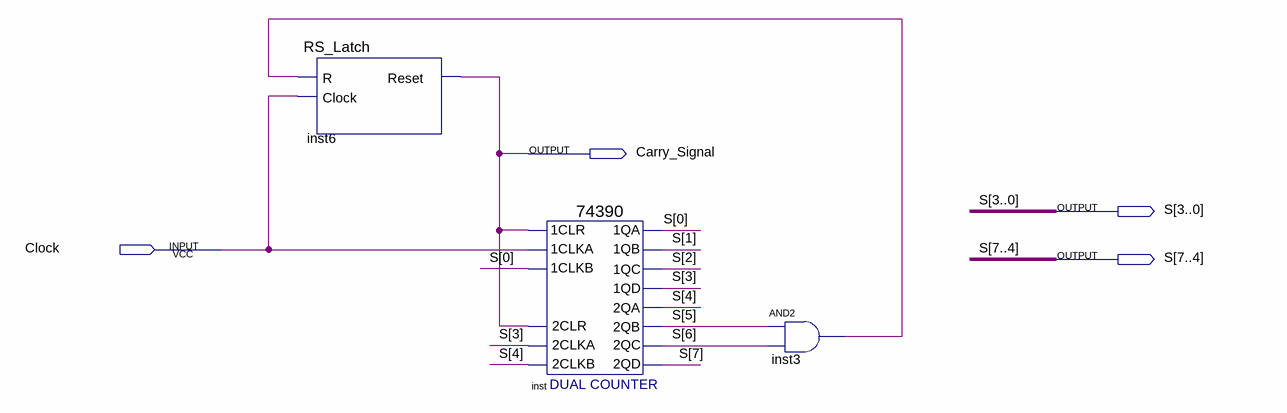
[diagram p0: schematic sheet]
// Quartus schematic Count_Second.bdf as structural Verilog: 3 symbols, 4 pins
module Count_Second (
  input  Clock,
  output Carry_Signal,
  output [7:0] S
);

  wire inst3_out;

  RS_Latch inst6 (.R(inst3_out), .Clock(Clock), .Reset(Carry_Signal));
  \74390  inst (
    .\2CLKA (S[3]), .\2CLR (Carry_Signal), .\2CLKB (S[4]), .\1CLR (Carry_Signal), .\1CLKA (Clock),
    .\1CLKB (S[0]), .\1QA (S[0]), .\1QB (S[1]), .\1QC (S[2]), .\1QD (S[3]), .\2QA (S[4]), .\2QB (S[5]),
    .\2QC (S[6]), .\2QD (S[7]));
  and inst3 (inst3_out, S[5], S[6]);
endmodule
